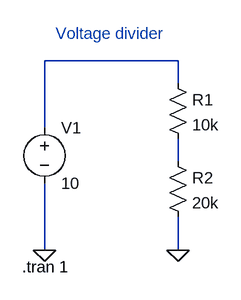
[diagram p0: schematic Draft1.asc]
Draft1.asc, the LTspice schematic file:
Version 4
SHEET 1 880 680
WIRE 128 80 -64 80
WIRE 128 112 128 80
WIRE -64 176 -64 80
WIRE 128 224 128 192
WIRE -64 352 -64 256
WIRE 128 352 128 304
FLAG -64 352 0
FLAG 128 352 0
SYMBOL res 112 96 R0
SYMATTR InstName R1
SYMATTR Value 10k
SYMBOL res 112 208 R0
SYMATTR InstName R2
SYMATTR Value 20k
SYMBOL voltage -64 160 R0
WINDOW 123 0 0 Left 0
WINDOW 39 0 0 Left 0
SYMATTR InstName V1
SYMATTR Value 10
TEXT -48 40 Left 2 ;Voltage divider
TEXT -96 376 Left 2 !.tran 1

The netlist it stands for:
* Draft1.asc
R1 N001 N002 10k
R2 N002 0 20k
V1 N001 0 10
* Voltage divider
.tran 1
.backanno
.end